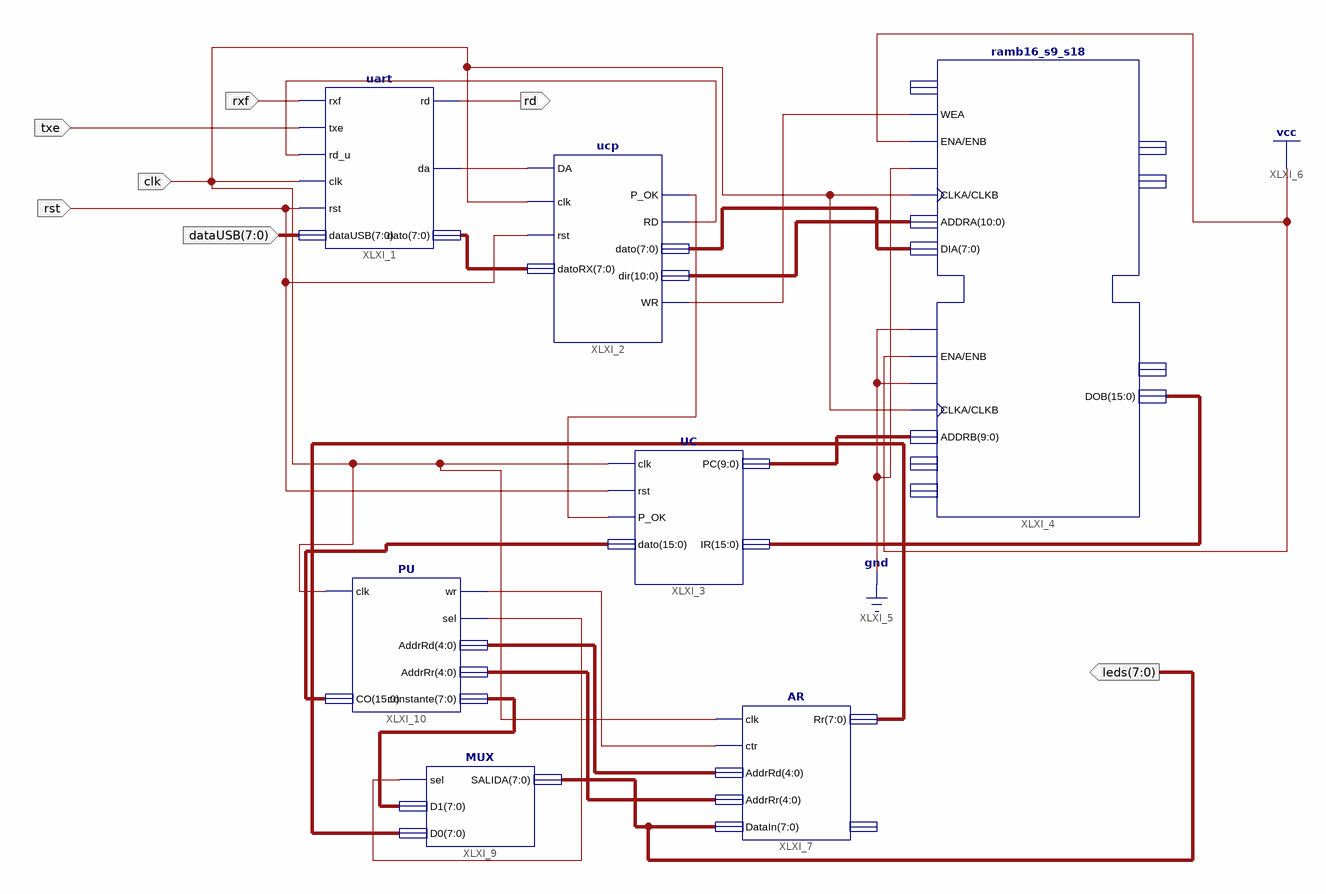
[diagram p0: schematic sheet 1]
// Xilinx ISE schematic top.sch (spartan3e) as structural Verilog: 7 symbols, 7 ports
module top (
  input  rxf,
  input  txe,
  input  rst,
  input  [7:0] dataUSB,
  input  clk,
  output rd,
  output [7:0] leds
);

  wire XLXN_1, XLXN_30, XLXN_36, XLXN_59, XLXN_85, XLXN_90;
  wire [4:0] XLXN_86, XLXN_87;
  wire [7:0] XLXN_3, XLXN_41, XLXN_92, XLXN_100;
  wire [9:0] XLXN_34;
  wire [10:0] XLXN_21;
  wire [15:0] XLXN_104, XLXN_105;

  uart XLXI_1 (
    .rxf(rxf), .txe(txe), .rd_u(XLXN_59), .clk(clk), .rst(rst), .dataUSB(dataUSB), .rd(rd), .da(XLXN_1),
    .dato(XLXN_3));
  ucp XLXI_2 (
    .DA(XLXN_1), .clk(clk), .rst(rst), .datoRX(XLXN_3), .WR(XLXN_36), .P_OK(XLXN_30), .RD(XLXN_59),
    .dato(XLXN_41), .dir(XLXN_21));
  UC XLXI_3 (.clk(clk), .rst(rst), .P_OK(XLXN_30), .IR(XLXN_104), .dato(XLXN_105), .PC(XLXN_34));
  ramb16_s9_s18 #(.INIT_00("0000000000000000000000000000000000000000000000000000000000111111"), .INIT_01("0200020002000200020002000200020002000200020002000200020002000200"), .INIT_02("0300030003000300030003000300030003000300030003000300030003000300")) XLXI_4 (
    .ADDRA(XLXN_21), .ADDRB(XLXN_34), .CLKA(clk), .CLKB(clk), .DIA(XLXN_41), .ENA(1'b1), .ENB(1'b1),
    .SSRA(1'b0), .SSRB(1'b0), .WEA(XLXN_36), .WEB(1'b0), .DOB(XLXN_104));  // open: DIB, DIPA, DIPB, DOA, DOPA, DOPB
  AR XLXI_7 (.clk(clk), .ctr(XLXN_85), .AddrRd(XLXN_86), .AddrRr(XLXN_87), .DataIn(leds), .Rr(XLXN_92));  // open: Rd
  MUX XLXI_9 (.sel(XLXN_90), .D1(XLXN_100), .D0(XLXN_92), .SALIDA(leds));
  PU XLXI_10 (
    .clk(clk), .CO(XLXN_105), .wr(XLXN_85), .sel(XLXN_90), .AddrRd(XLXN_86), .AddrRr(XLXN_87),
    .constante(XLXN_100));
endmodule
